# Altium schematic sheet gps.SchDoc
size A4; DocumentNumber: P24; SheetNumber: 4; SheetTotal: 5
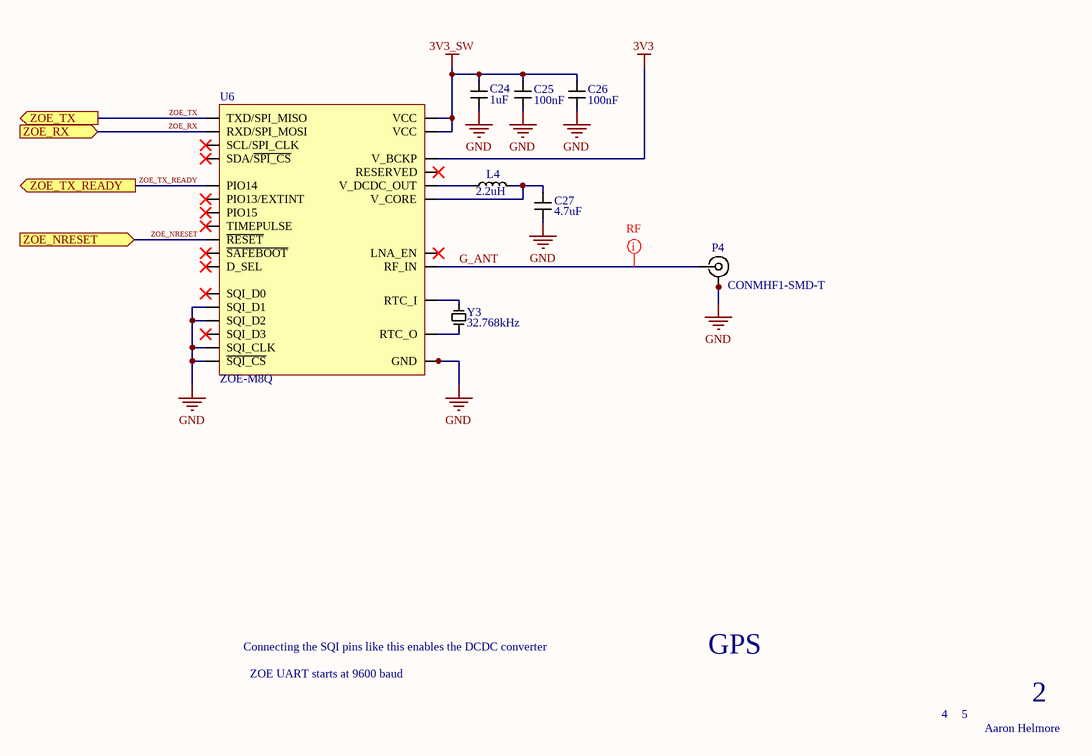
[diagram p0: gps.SchDoc]

## Parts
C24  1uF  [CAP_0402]
C25  100nF  [CAP_0402]
C26  100nF  [CAP_0402]
C27  4.7uF  [CAP_0603]
L4  2.2uH  [LQM2MPNxxxx]
P4  CONMHF1-SMD-T  [CONMHF1-SMD-T]
U6  ZOE-M8Q  [ZOE-M8Q]
Y3  32.768kHz  [2-SMD]

## Ports
ZOE_NRESET (in), ZOE_RX (in), ZOE_TX (out), ZOE_TX_READY (out)

## Nets
3V3: U6.H9(V_BCKP)
3V3_SW: C24.2(J11) C25.2(J11) C26.2(J11) U6.J1(VCC) U6.J2(VCC)
GND: C24.1(J12) C25.1(J12) C26.1(J12) C27.1(J12) P4.2(VCC) P4.3(VCC) P4.4(VCC) U6.A1(GND) U6.A3(GND) U6.A5(GND) U6.A7(GND) U6.A8(GND) U6.A9(GND) U6.B9(GND) U6.C1(SQI_D1) U6.C7(GND) U6.C9(GND) U6.D3(~{SQI_CS}) U6.D6(GND) U6.D9(GND) U6.E1(SQI_CLK) U6.E3(SQI_D2) U6.E7(GND) U6.F7(GND) U6.G3(GND) U6.G6(GND) U6.G7(GND) U6.J3(GND) U6.J9(GND)
G_ANT: P4.1(VCC) U6.A4(RF_IN)
ZOE_NRESET: U6.J6(~{RESET}) ; port ZOE_NRESET
ZOE_RX: U6.J4(RXD/SPI_MOSI) ; port ZOE_RX
ZOE_TX: U6.J5(TXD/SPI_MISO) ; port ZOE_TX
ZOE_TX_READY: U6.F6(PIO14) ; port ZOE_TX_READY
NetC27_2: C27.2(J11) L4.2 U6.G1(V_CORE)
NetL4_1: L4.1 U6.H1(V_DCDC_OUT)
NetU6_J7: U6.J7(RTC_I) Y3.2
NetU6_J8: U6.J8(RTC_O) Y3.1

Not connected (* = marked no-connect by the designer): U6 A2(SDA/~{SPI_CS})* B1(SCL/SPI_CLK)* C3(TIMEPULSE)* C4(~{SAFEBOOT})* C5(LNA_EN)* C6(PIO15)* D1(SQI_D0)* D4(D_SEL)* F3(SQI_D3)* G4(PIO13/EXTINT)* G9(RESERVED)*

## Layout directives
rule Impedance Constraint [Min = 49.50    Max = 50.50    ]; net class ZOE_RF_LINES: G_ANT

## Notes on the sheet
- Connecting the SQI pins like this enables the DCDC converter
- ZOE UART starts at 9600 baud
- GPS
- 4
- 5
- 2
- Aaron Helmore

## Library data of the parts
C24-C26 = Capacitor: Dielectric: X5R; Voltage: 25V
C27 = Capacitor: Dielectric: X5R; Voltage: 6.3V
L4 = Inductor
U6 = ZOE-M8Q: ublox GPS/GNSS receiver
Y3 = Crystal_2_1